# EAGLE design USB-DA-MINI (EAGLE 6.6.0)
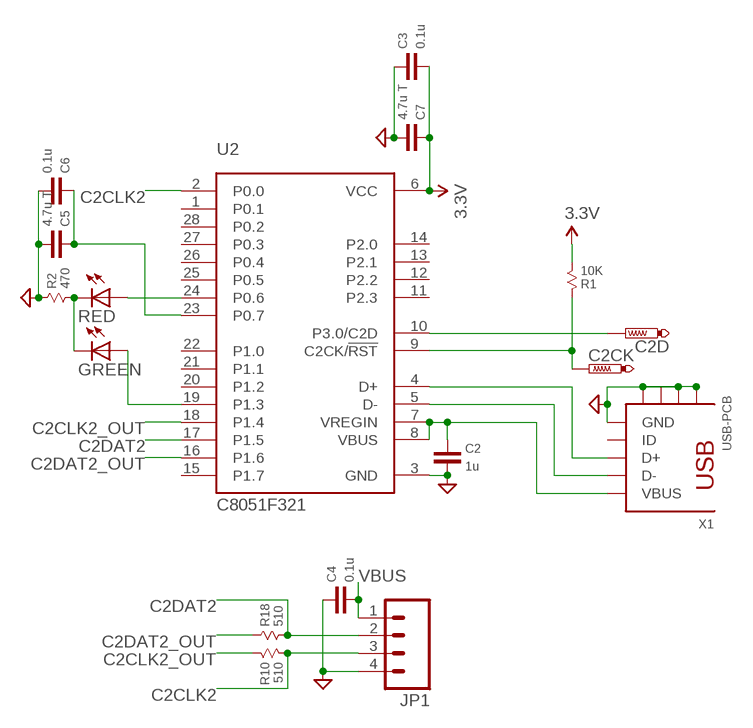
[diagram p0: schematic, sheet 1]

## Parts
C2  1u  CAP-0603  [0603]
C2CK  PTR1B1,27  [B1,27]
C2D  PTR1B1,27  [B1,27]
C3  0.1u  CAP-0603  [0603]
C4  0.1u  CAP-0603  [0603]
C5  4.7u T  CAP-0603  [0603]
C6  0.1u  CAP-0603  [0603]
C7  4.7u T  CAP-0603  [0603]
GREEN  LED0603  [LED-0603]
JP1  M04PTH  [1X04]
R1  10K  RESISTOR-0603  [0603]
R2  470  RESISTOR-0603  [0603]
R10  510  RESISTOR-0603  [0603]
R18  510  RESISTOR-0603  [0603]
RED  LED0603  [LED-0603]
U2  C8051F321  [QFN28-5X5]
X1  USB-PCB  USB-SMD  [USB-MINIB]

## Nets
3.3V: C3.1 C7.2 R1.2 U2.6(VCC)
C2CLK2: JP1.3 R10.2 U2.2(P0.0)
C2CLK2_OUT: R10.1 U2.18(P1.4)
C2DAT2: JP1.2 R18.2 U2.17(P1.5)
C2DAT2_OUT: R18.1 U2.16(P1.6)
D+: U2.4(D+) X1.D+
D-: U2.5(D-) X1.D-
GND: C2.1 C3.2 C4.2 C5.1 C6.1 C7.1 JP1.4 R2.1 U2.3(GND) X1.GND X1.GND@1(GND) X1.GND@2(GND) X1.GND@3(GND) X1.GND@4(GND)
LED_GREEN: GREEN.A U2.19(P1.3)
LED_RED: RED.A U2.24(P0.6)
N$1: C5.2 C6.2 U2.23(P0.7)
N$5: GREEN.C R2.2 RED.C
RST: C2CK.TP R1.1 U2.9(C2CK/!RST)
TDI_AI: C2D.TP U2.10(P3.0/C2D)
VBUS: C2.2 C4.1 JP1.1 U2.7(VREGIN) U2.8(VBUS) X1.VBUS
Unconnected: U2.1(P0.1) U2.11(P2.3) U2.12(P2.2) U2.13(P2.1) U2.14(P2.0) U2.15(P1.7) U2.20(P1.2) U2.21(P1.1) U2.22(P1.0) U2.25(P0.5) U2.26(P0.4) U2.27(P0.3) U2.28(P0.2) X1.ID

## Library data of the parts
C2-C7 = X893:CAP: Capacitor
C2CK C2D = testpad:PTR1: TEST PIN
GREEN RED = SparkFun:LED: LEDs Standard schematic elements and footprints for 5mm, 3mm, 1206, and 0603 sized LEDs. 5mm - Spark Fun Electronics SKU : COM-00529 (and others)
JP1 = SparkFun:M04: Header 4 Standard 4-pin 0.1" header. Use with straight break away headers (SKU : PRT-00116), right angle break away headers (PRT-00553), swiss pins (PRT-00743), machine pins (PRT-00117), and female headers (PRT-00115). Molex polarized connector foot print use with SKU : PRT-08231 with associated crimp pins and housings.
R1 R2 R10 R18 = X893:RESISTOR
U2 = X893:C8051F321
X1 = X893:USB: USB Connectors USB-B-PTH is fully proven SKU : PRT-00139 USB-miniB is fully proven SKU : PRT-00587 USB-A-PCB is untested. USB-A-H is throughly reviewed, but untested. Spark Fun Electronics SKU : PRT-00437 USB-B-SMT is throughly reviewed, but untested. Needs silkscreen touching up. USB-A-S has not been used/tested USB-MB-H has not been used/tested

## Board
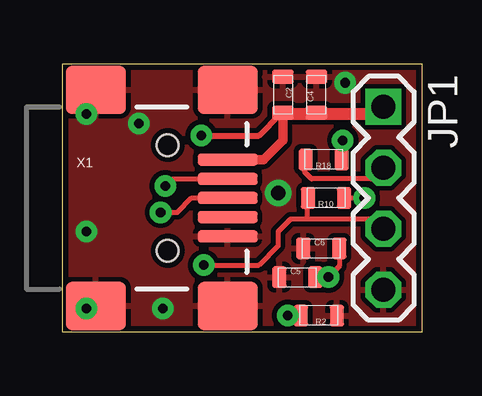
[diagram p1: board, top side]
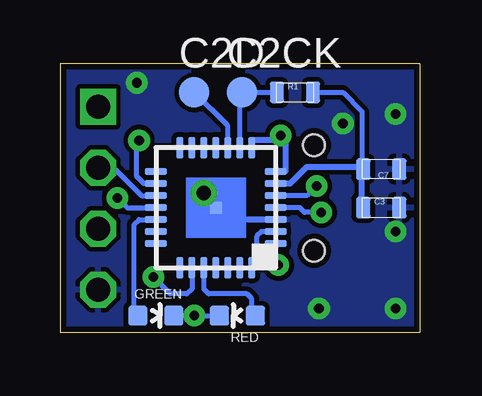
[diagram p2: board, bottom side, seen from below]

Size 15 x 11.2 mm. Coordinates in mm from the lower left corner, seen from the top.
Outline: 0,11.2 15,11.2 15,0 0,0 0,11.2
Copper layers (1+16): Top 0.035mm / dielectric 1.5mm / Bottom 0.035mm
Design rules "Rezonit": minimum track width 0.2mm, minimum drill 0.4mm, track to track 0.2mm, track to pad 0.2mm, pad to pad 0.2mm, via to via 0.2mm, smd to smd 0mil, copper to edge 0.25mm, drill to drill 0.4mm, minimum pad ring 0.25mm, minimum via ring 0.25mm, stop-mask expansion 4mil, vias tented up to drill 0.4mm, thermal gap 0.2mm

### Footprints (pad centres in the part's own frame; a part is rotated, then mirrored left to right if it is on the bottom)
0603 = smd 0.6 x 0.9: 1 -0.75,0; 2 0.75,0
B1,27 = smd 1.27 x 1.27: TP 0,0
LED-0603 = smd 0.8 x 0.8: A 0,-0.75; C 0,0.75
1X04 = drill 1 pad 1.5 square: 1 0,0 | drill 1 pad 1.5 octagon: 2 2.54,0; 3 5.08,0; 4 7.62,0
QFN28-5X5 = smd 0.3 x 0.9: 1 -1.5,-2.5; 2 -1,-2.5; 3 -0.5,-2.5; 4 0,-2.5; 5 0.5,-2.5; 6 1,-2.5; 7 1.5,-2.5; 15 1.5,2.5; 16 1,2.5; 17 0.5,2.5; 18 0,2.5; 19 -0.5,2.5; 20 -1,2.5; 21 -1.5,2.5 | smd 0.9 x 0.3: 8 2.5,-1.5; 9 2.5,-1; 10 2.5,-0.5; 11 2.5,0; 12 2.5,0.5; 13 2.5,1; 14 2.5,1.5; 22 -2.5,1.5; 23 -2.5,1; 24 -2.5,0.5; 25 -2.5,0; 26 -2.5,-0.5; 27 -2.5,-1; 28 -2.5,-1.5 | smd 0.5 x 0.5: EP 0,0
USB-MINIB = smd 2.5 x 0.5: D+ 2.5,0; D- 2.5,0.8; GND 2.5,-1.6; ID 2.5,-0.8; VBUS 2.5,1.6 | smd 2.5 x 2: GND@1 -3,-4.5; GND@2 -3,4.5; GND@3 2.5,4.5; GND@4 2.5,-4.5 | hole 0.9: 0,2.2; 0,-2.2

### Placement (x,y rotation side)
C2  9.2,9.9 270 top
C2CK  7.4,10 0 bottom
C2D  9.4,10 0 bottom
C3  1.6,5.2 0 bottom
C4  10.6,9.9 90 top
C5  9.8,2.3 0 top
C6  10.8,3.5 0 top
C7  1.6,6.8 180 bottom
GREEN  11,0.7 270 bottom
JP1  13.4,9.4 270 top
R1  5.2,10 0 bottom
R2  10.7,0.7 180 top
R10  11,5.6 180 top
R18  10.9,7.2 180 top
RED  7.6,0.7 90 bottom
U2  8.5,5.2 90 bottom
X1  4.4,5.6 0 top

### Tracks (layer width: path | path; a pad name or v marks a point on that pad's centre or on a via)
3.3V
  Bottom 0.2: R1.2 3.2,10 2.4,9.2 2.4,6.85 C7.2
  Bottom 0.25: U2.6 5.4,6.2 4.7,6.9 2.25,6.9 C7.2 2.4,6.75 2.4,5.2 C3.1
C2CLK2  (via drill 0.4)
  Top 0.2: v5.9,2.8 8.2,2.8 9,3.6 9,4.2 9.52,4.72 10.2,4.72 | JP1.3 13.3,4.3 12.88,4.72 10.2,4.72 | R10.2 10.2,5.6 10.2,4.72
  Bottom 0.2: U2.2 6.6,4.2 6.8,4 6.8,3.5 6.1,2.8 v5.9,2.8
C2CLK2_OUT  (via drill 0.4)
  Top 0.2: R10.1 v12.6,5.6
  Bottom 0.2: U2.18 12.2,5.2 v12.6,5.6
C2DAT2
  Top 0.2: JP1.2 13.34,6.8 13.3,6.8 12.9,6.4 10.4,6.4 10.1,6.7 10.1,7.2 R18.2
  Bottom 0.2: U2.17 11.6,5.7 12.7,6.8 13.14,6.8 JP1.2
C2DAT2_OUT  (via drill 0.4)
  Top 0.2: v11.7,8 11.7,7.2 R18.1
  Bottom 0.2: U2.16 11.5,6.2 11.8,6.5 11.8,7.9 v11.7,8
D+  (via drill 0.4)
  Top 0.2: X1.D+ 5.4,5.6 4.8,5 v4.1,5
  Bottom 0.2: U2.4 5,5.2 4.8,5 v4.1,5
D-  (via drill 0.4)
  Top 0.2: X1.D- 4.6,6.4 v4.3,6.1
  Bottom 0.2: U2.5 4.7,5.7 v4.3,6.1
GND  (via drill 0.4, 0.6)
  Bottom 0.25: U2.3 9,4.7 v9,5.8
  other vias: 1,1 4.2,1 1,4.2 1,9.1 11.8,10.4 3.2,8.7
  pour Top (isolate 0.2): 0.2,11 0.2,0.2 15,0.2 15,11
  pour Bottom (isolate 0.2): 0.2,11 0.2,0.2 15,0.2 15,11
LED_GREEN
  Bottom 0.2: U2.19 11.7,4.7 11.9,4.5 11.9,1.05 GREEN.A
LED_RED
  Bottom 0.2: U2.24 9,1.8 8.8,1.6 7.2,1.6 7,1.4 7,0.85 RED.A
N$1  (via drill 0.4)
  Top 0.2: C6.2 11.55,2.75 v11.1,2.3 C5.2
  Bottom 0.2: U2.23 9.5,1.8 9.7,1.6 10.4,1.6 v11.1,2.3
N$5  (via drill 0.4)
  Top 0.2: R2.2 v9.4,0.7
  Bottom 0.2: RED.C v9.4,0.7 10.2,0.7 10.25,0.75 GREEN.C
RST
  Bottom 0.2: U2.9 7.5,9.5 C2CK.TP R1.1
TDI_AI
  Bottom 0.2: U2.10 8,8.6 C2D.TP
VBUS  (via drill 0.4)
  Top 0.2: C4.1 10.6,9.1
  Top 0.25: 9.2,9.1 9.1,9.1 8.2,8.2 v5.8,8.2
  Top 0.4: 13.1,9.1 JP1.1 | X1.VBUS 8.4,7.2 9.2,8 9.2,9.1 C2.2
  Top 0.5: 9.2,9.1 10.6,9.1 13.1,9.1
  Bottom 0.2: 7,8 U2.8
  Bottom 0.25: 7,8 6,8 v5.8,8.2 5.6,8 5.6,6.7 U2.7

### Text on the board
Reference: +5V | C2DAT | C2CLK | GND